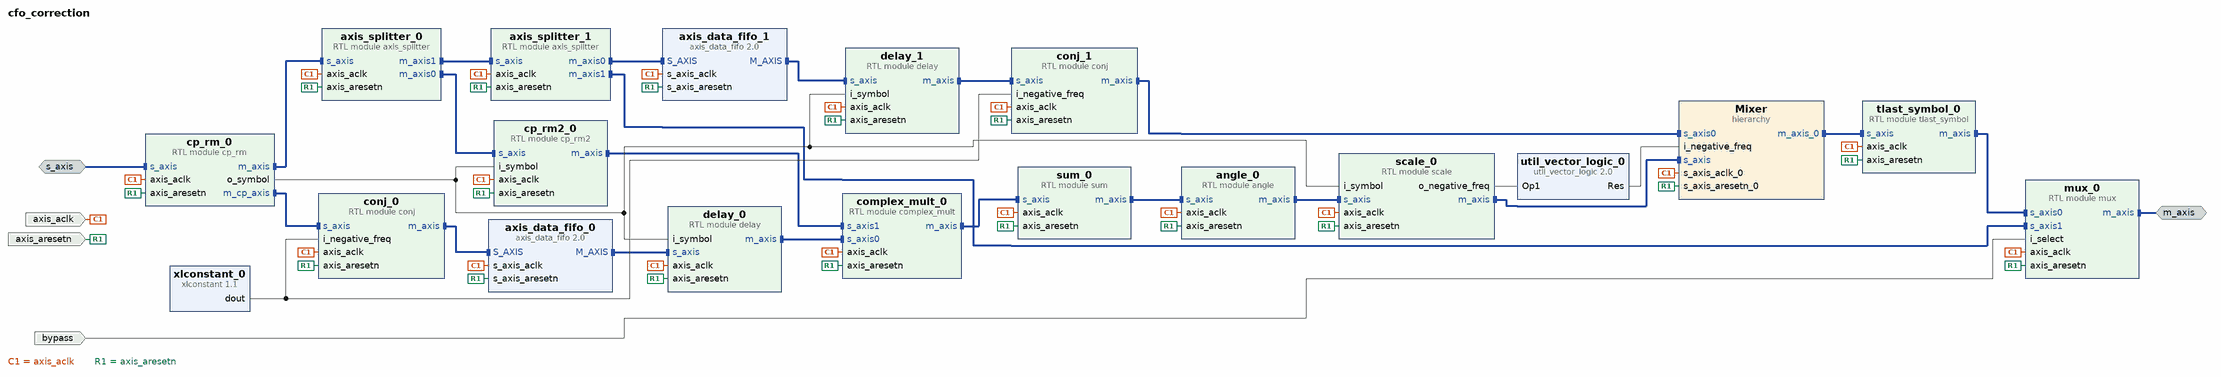
[diagram p0: block diagram of the top level]
# Vivado block design cfo_correction, xczu28dr-ffvg1517-2-e, Vivado 2022.1
create_bd_design cfo_correction

create_bd_intf_port -mode Master -vlnv xilinx.com:interface:axis_rtl:1.0 m_axis
set_property -dict {CONFIG.FREQ_HZ 249997498} [get_bd_intf_ports m_axis]
create_bd_intf_port -mode Slave -vlnv xilinx.com:interface:axis_rtl:1.0 s_axis
set_property -dict [list \
  CONFIG.FREQ_HZ 249997498 \
  CONFIG.HAS_TKEEP 0 \
  CONFIG.HAS_TLAST 1 \
  CONFIG.HAS_TREADY 0 \
  CONFIG.HAS_TSTRB 0 \
  CONFIG.LAYERED_METADATA undef \
  CONFIG.TDATA_NUM_BYTES 16 \
  CONFIG.TDEST_WIDTH 0 \
  CONFIG.TID_WIDTH 8 \
  CONFIG.TUSER_WIDTH 8 \
] [get_bd_intf_ports s_axis]
create_bd_port -dir I -type clk axis_aclk
set_property -dict [list \
  CONFIG.ASSOCIATED_BUSIF s_axis:m_axis \
  CONFIG.ASSOCIATED_RESET axis_aresetn \
  CONFIG.FREQ_HZ 249997498 \
] [get_bd_ports axis_aclk]
create_bd_port -dir I -type rst axis_aresetn
create_bd_port -dir I bypass

create_bd_cell -type hier Mixer
create_bd_cell -type module -reference angle angle_0
create_bd_cell -type ip -vlnv xilinx.com:ip:axis_data_fifo:2.0 axis_data_fifo_0
create_bd_cell -type ip -vlnv xilinx.com:ip:axis_data_fifo:2.0 axis_data_fifo_1
set_property -dict {CONFIG.FIFO_DEPTH 1024} [get_bd_cells axis_data_fifo_1]
create_bd_cell -type module -reference axis_splitter axis_splitter_0
create_bd_cell -type module -reference axis_splitter axis_splitter_1
create_bd_cell -type module -reference complex_mult complex_mult_0
create_bd_cell -type module -reference conj conj_0
create_bd_cell -type module -reference conj conj_1
create_bd_cell -type module -reference cp_rm2 cp_rm2_0
create_bd_cell -type module -reference cp_rm cp_rm_0
create_bd_cell -type module -reference delay delay_0
set_property -dict {CONFIG.g_ACTIVE_CYCLES 64 CONFIG.g_DELAY_CYCLES 253 CONFIG.g_QUIET_CYCLES 256} [get_bd_cells delay_0]
create_bd_cell -type module -reference delay delay_1
set_property -dict {CONFIG.g_DELAY_CYCLES 310} [get_bd_cells delay_1]
create_bd_cell -type module -reference mux mux_0
create_bd_cell -type module -reference scale scale_0
create_bd_cell -type module -reference sum sum_0
create_bd_cell -type module -reference tlast_symbol tlast_symbol_0
create_bd_cell -type ip -vlnv xilinx.com:ip:util_vector_logic:2.0 util_vector_logic_0
set_property -dict {CONFIG.C_OPERATION not CONFIG.C_SIZE 1} [get_bd_cells util_vector_logic_0]
create_bd_cell -type ip -vlnv xilinx.com:ip:xlconstant:1.1 xlconstant_0
set_property -dict {CONFIG.CONST_VAL 0} [get_bd_cells xlconstant_0]

# ---- hierarchy /Mixer ----
current_bd_instance /Mixer
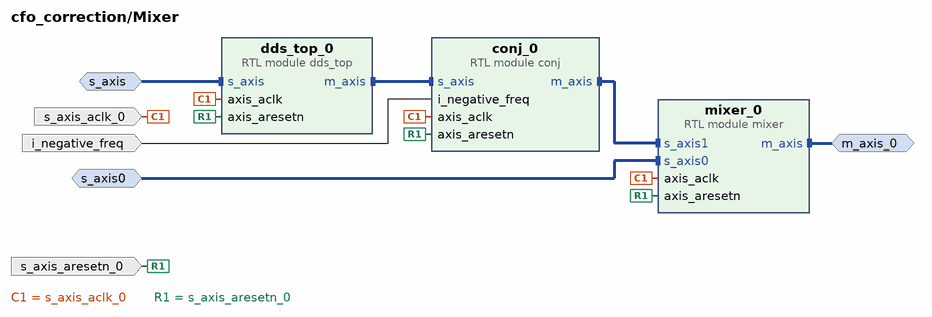
[diagram p1: block diagram inside /Mixer]
create_bd_intf_pin -mode Master -vlnv xilinx.com:interface:axis_rtl:1.0 m_axis_0
create_bd_intf_pin -mode Slave -vlnv xilinx.com:interface:axis_rtl:1.0 s_axis
create_bd_intf_pin -mode Slave -vlnv xilinx.com:interface:axis_rtl:1.0 s_axis0
create_bd_pin -dir I i_negative_freq
create_bd_pin -dir I -type clk s_axis_aclk_0
create_bd_pin -dir I -type rst s_axis_aresetn_0

create_bd_cell -type module -reference conj conj_0
create_bd_cell -type module -reference dds_top dds_top_0
create_bd_cell -type module -reference mixer mixer_0

# ---- connections ----

current_bd_instance /Mixer
connect_bd_intf_net [get_bd_intf_pins m_axis_0] [get_bd_intf_pins mixer_0/m_axis]
connect_bd_intf_net -intf_net angle_0_m_axis [get_bd_intf_pins s_axis] [get_bd_intf_pins dds_top_0/s_axis]
connect_bd_intf_net [get_bd_intf_pins conj_0/m_axis] [get_bd_intf_pins mixer_0/s_axis1]
connect_bd_intf_net [get_bd_intf_pins conj_0/s_axis] [get_bd_intf_pins dds_top_0/m_axis]
connect_bd_intf_net -intf_net delay_1_m_axis [get_bd_intf_pins s_axis0] [get_bd_intf_pins mixer_0/s_axis0]
connect_bd_net [get_bd_pins i_negative_freq] [get_bd_pins conj_0/i_negative_freq]
connect_bd_net -net s_axis_aclk_0_1 [get_bd_pins s_axis_aclk_0] \
  [get_bd_pins conj_0/axis_aclk] [get_bd_pins dds_top_0/axis_aclk] [get_bd_pins mixer_0/axis_aclk]
connect_bd_net -net s_axis_aresetn_0_1 [get_bd_pins s_axis_aresetn_0] \
  [get_bd_pins conj_0/axis_aresetn] [get_bd_pins dds_top_0/axis_aresetn] [get_bd_pins mixer_0/axis_aresetn]

current_bd_instance /
connect_bd_intf_net [get_bd_intf_pins Mixer/m_axis_0] [get_bd_intf_pins tlast_symbol_0/s_axis]
connect_bd_intf_net [get_bd_intf_pins angle_0/m_axis] [get_bd_intf_pins scale_0/s_axis]
connect_bd_intf_net [get_bd_intf_pins axis_data_fifo_0/M_AXIS] [get_bd_intf_pins delay_0/s_axis]
connect_bd_intf_net [get_bd_intf_pins axis_data_fifo_1/M_AXIS] [get_bd_intf_pins delay_1/s_axis]
connect_bd_intf_net [get_bd_intf_pins axis_splitter_0/m_axis0] [get_bd_intf_pins cp_rm2_0/s_axis]
connect_bd_intf_net [get_bd_intf_pins axis_splitter_0/m_axis1] [get_bd_intf_pins axis_splitter_1/s_axis]
connect_bd_intf_net [get_bd_intf_pins axis_data_fifo_1/S_AXIS] [get_bd_intf_pins axis_splitter_1/m_axis0]
connect_bd_intf_net [get_bd_intf_pins axis_splitter_1/m_axis1] [get_bd_intf_pins mux_0/s_axis1]
connect_bd_intf_net [get_bd_intf_pins complex_mult_0/m_axis] [get_bd_intf_pins sum_0/s_axis]
connect_bd_intf_net [get_bd_intf_pins axis_data_fifo_0/S_AXIS] [get_bd_intf_pins conj_0/m_axis]
connect_bd_intf_net [get_bd_intf_pins Mixer/s_axis0] [get_bd_intf_pins conj_1/m_axis]
connect_bd_intf_net [get_bd_intf_pins complex_mult_0/s_axis1] [get_bd_intf_pins cp_rm2_0/m_axis]
connect_bd_intf_net [get_bd_intf_pins axis_splitter_0/s_axis] [get_bd_intf_pins cp_rm_0/m_axis]
connect_bd_intf_net [get_bd_intf_pins conj_0/s_axis] [get_bd_intf_pins cp_rm_0/m_cp_axis]
connect_bd_intf_net [get_bd_intf_pins complex_mult_0/s_axis0] [get_bd_intf_pins delay_0/m_axis]
connect_bd_intf_net [get_bd_intf_pins conj_1/s_axis] [get_bd_intf_pins delay_1/m_axis]
connect_bd_intf_net [get_bd_intf_ports m_axis] [get_bd_intf_pins mux_0/m_axis]
connect_bd_intf_net -intf_net s_axis_0_1 [get_bd_intf_ports s_axis] [get_bd_intf_pins cp_rm_0/s_axis]
connect_bd_intf_net [get_bd_intf_pins Mixer/s_axis] [get_bd_intf_pins scale_0/m_axis]
connect_bd_intf_net [get_bd_intf_pins angle_0/s_axis] [get_bd_intf_pins sum_0/m_axis]
connect_bd_intf_net [get_bd_intf_pins mux_0/s_axis0] [get_bd_intf_pins tlast_symbol_0/m_axis]
connect_bd_net [get_bd_pins cp_rm_0/o_symbol] \
  [get_bd_pins cp_rm2_0/i_symbol] [get_bd_pins delay_0/i_symbol] [get_bd_pins delay_1/i_symbol] \
  [get_bd_pins scale_0/i_symbol]
connect_bd_net -net i_select_0_1 [get_bd_ports bypass] [get_bd_pins mux_0/i_select]
connect_bd_net -net s_axis_aclk_0_1 [get_bd_ports axis_aclk] \
  [get_bd_pins Mixer/s_axis_aclk_0] [get_bd_pins angle_0/axis_aclk] [get_bd_pins axis_data_fifo_0/s_axis_aclk] \
  [get_bd_pins axis_data_fifo_1/s_axis_aclk] [get_bd_pins axis_splitter_0/axis_aclk] [get_bd_pins axis_splitter_1/axis_aclk] \
  [get_bd_pins complex_mult_0/axis_aclk] [get_bd_pins conj_0/axis_aclk] [get_bd_pins conj_1/axis_aclk] \
  [get_bd_pins cp_rm2_0/axis_aclk] [get_bd_pins cp_rm_0/axis_aclk] [get_bd_pins delay_0/axis_aclk] \
  [get_bd_pins delay_1/axis_aclk] [get_bd_pins mux_0/axis_aclk] [get_bd_pins scale_0/axis_aclk] [get_bd_pins sum_0/axis_aclk] \
  [get_bd_pins tlast_symbol_0/axis_aclk]
connect_bd_net -net s_axis_aresetn_0_1 [get_bd_ports axis_aresetn] \
  [get_bd_pins Mixer/s_axis_aresetn_0] [get_bd_pins angle_0/axis_aresetn] [get_bd_pins axis_data_fifo_0/s_axis_aresetn] \
  [get_bd_pins axis_data_fifo_1/s_axis_aresetn] [get_bd_pins axis_splitter_0/axis_aresetn] \
  [get_bd_pins axis_splitter_1/axis_aresetn] [get_bd_pins complex_mult_0/axis_aresetn] [get_bd_pins conj_0/axis_aresetn] \
  [get_bd_pins conj_1/axis_aresetn] [get_bd_pins cp_rm2_0/axis_aresetn] [get_bd_pins cp_rm_0/axis_aresetn] \
  [get_bd_pins delay_0/axis_aresetn] [get_bd_pins delay_1/axis_aresetn] [get_bd_pins mux_0/axis_aresetn] \
  [get_bd_pins scale_0/axis_aresetn] [get_bd_pins sum_0/axis_aresetn] [get_bd_pins tlast_symbol_0/axis_aresetn]
connect_bd_net [get_bd_pins scale_0/o_negative_freq] [get_bd_pins util_vector_logic_0/Op1]
connect_bd_net [get_bd_pins util_vector_logic_0/Res] [get_bd_pins Mixer/i_negative_freq]
connect_bd_net [get_bd_pins xlconstant_0/dout] [get_bd_pins conj_0/i_negative_freq] [get_bd_pins conj_1/i_negative_freq]

validate_bd_design
save_bd_design
